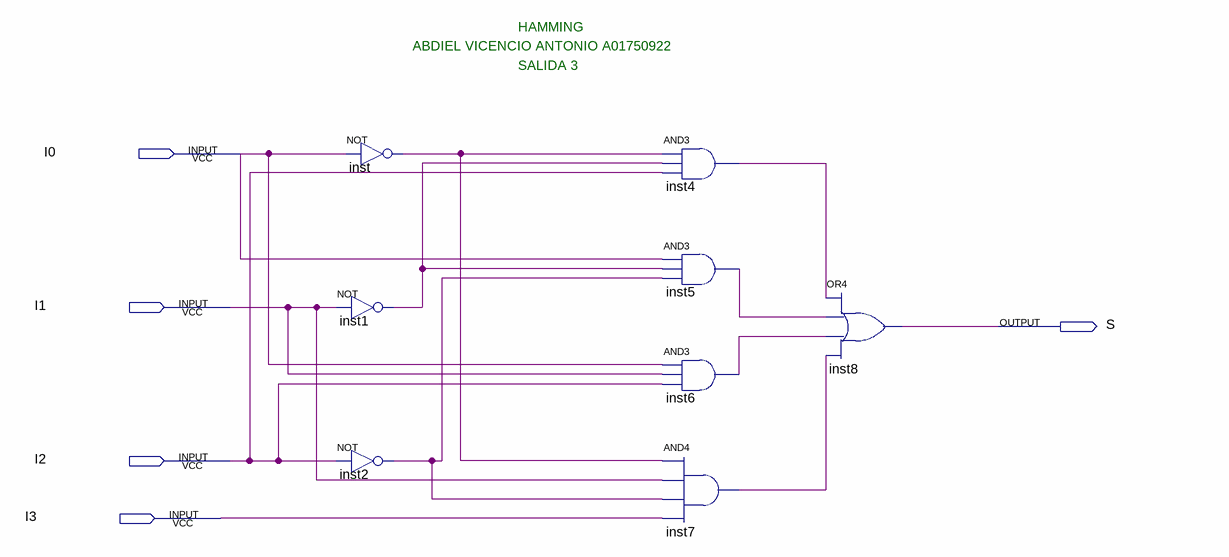
[diagram p0: schematic sheet]
// Quartus schematic HAMMINGS3.bdf as structural Verilog: 8 symbols, 5 pins
module HAMMINGS3 (
  input  I0,
  input  I1,
  input  I2,
  input  I3,
  output S
);

  wire inst1_out, inst2_out, inst4_out, inst5_out, inst6_out, inst7_out, inst_out;

  not inst1 (inst1_out, I1);
  not inst2 (inst2_out, I2);
  not inst (inst_out, I0);
  and inst4 (inst4_out, inst_out, inst1_out, I2);
  and inst5 (inst5_out, I0, inst1_out, inst2_out);
  and inst6 (inst6_out, I0, I1, I2);
  and inst7 (inst7_out, inst_out, I1, inst2_out, I3);
  or inst8 (S, inst4_out, inst5_out, inst6_out, inst7_out);

  // Notes on the sheet:
  //   HAMMING
  //   ABDIEL VICENCIO ANTONIO A01750922
  //   SALIDA 3
endmodule
